# Altium schematic sheet MCU.SchDoc
size 420 x 297 mm
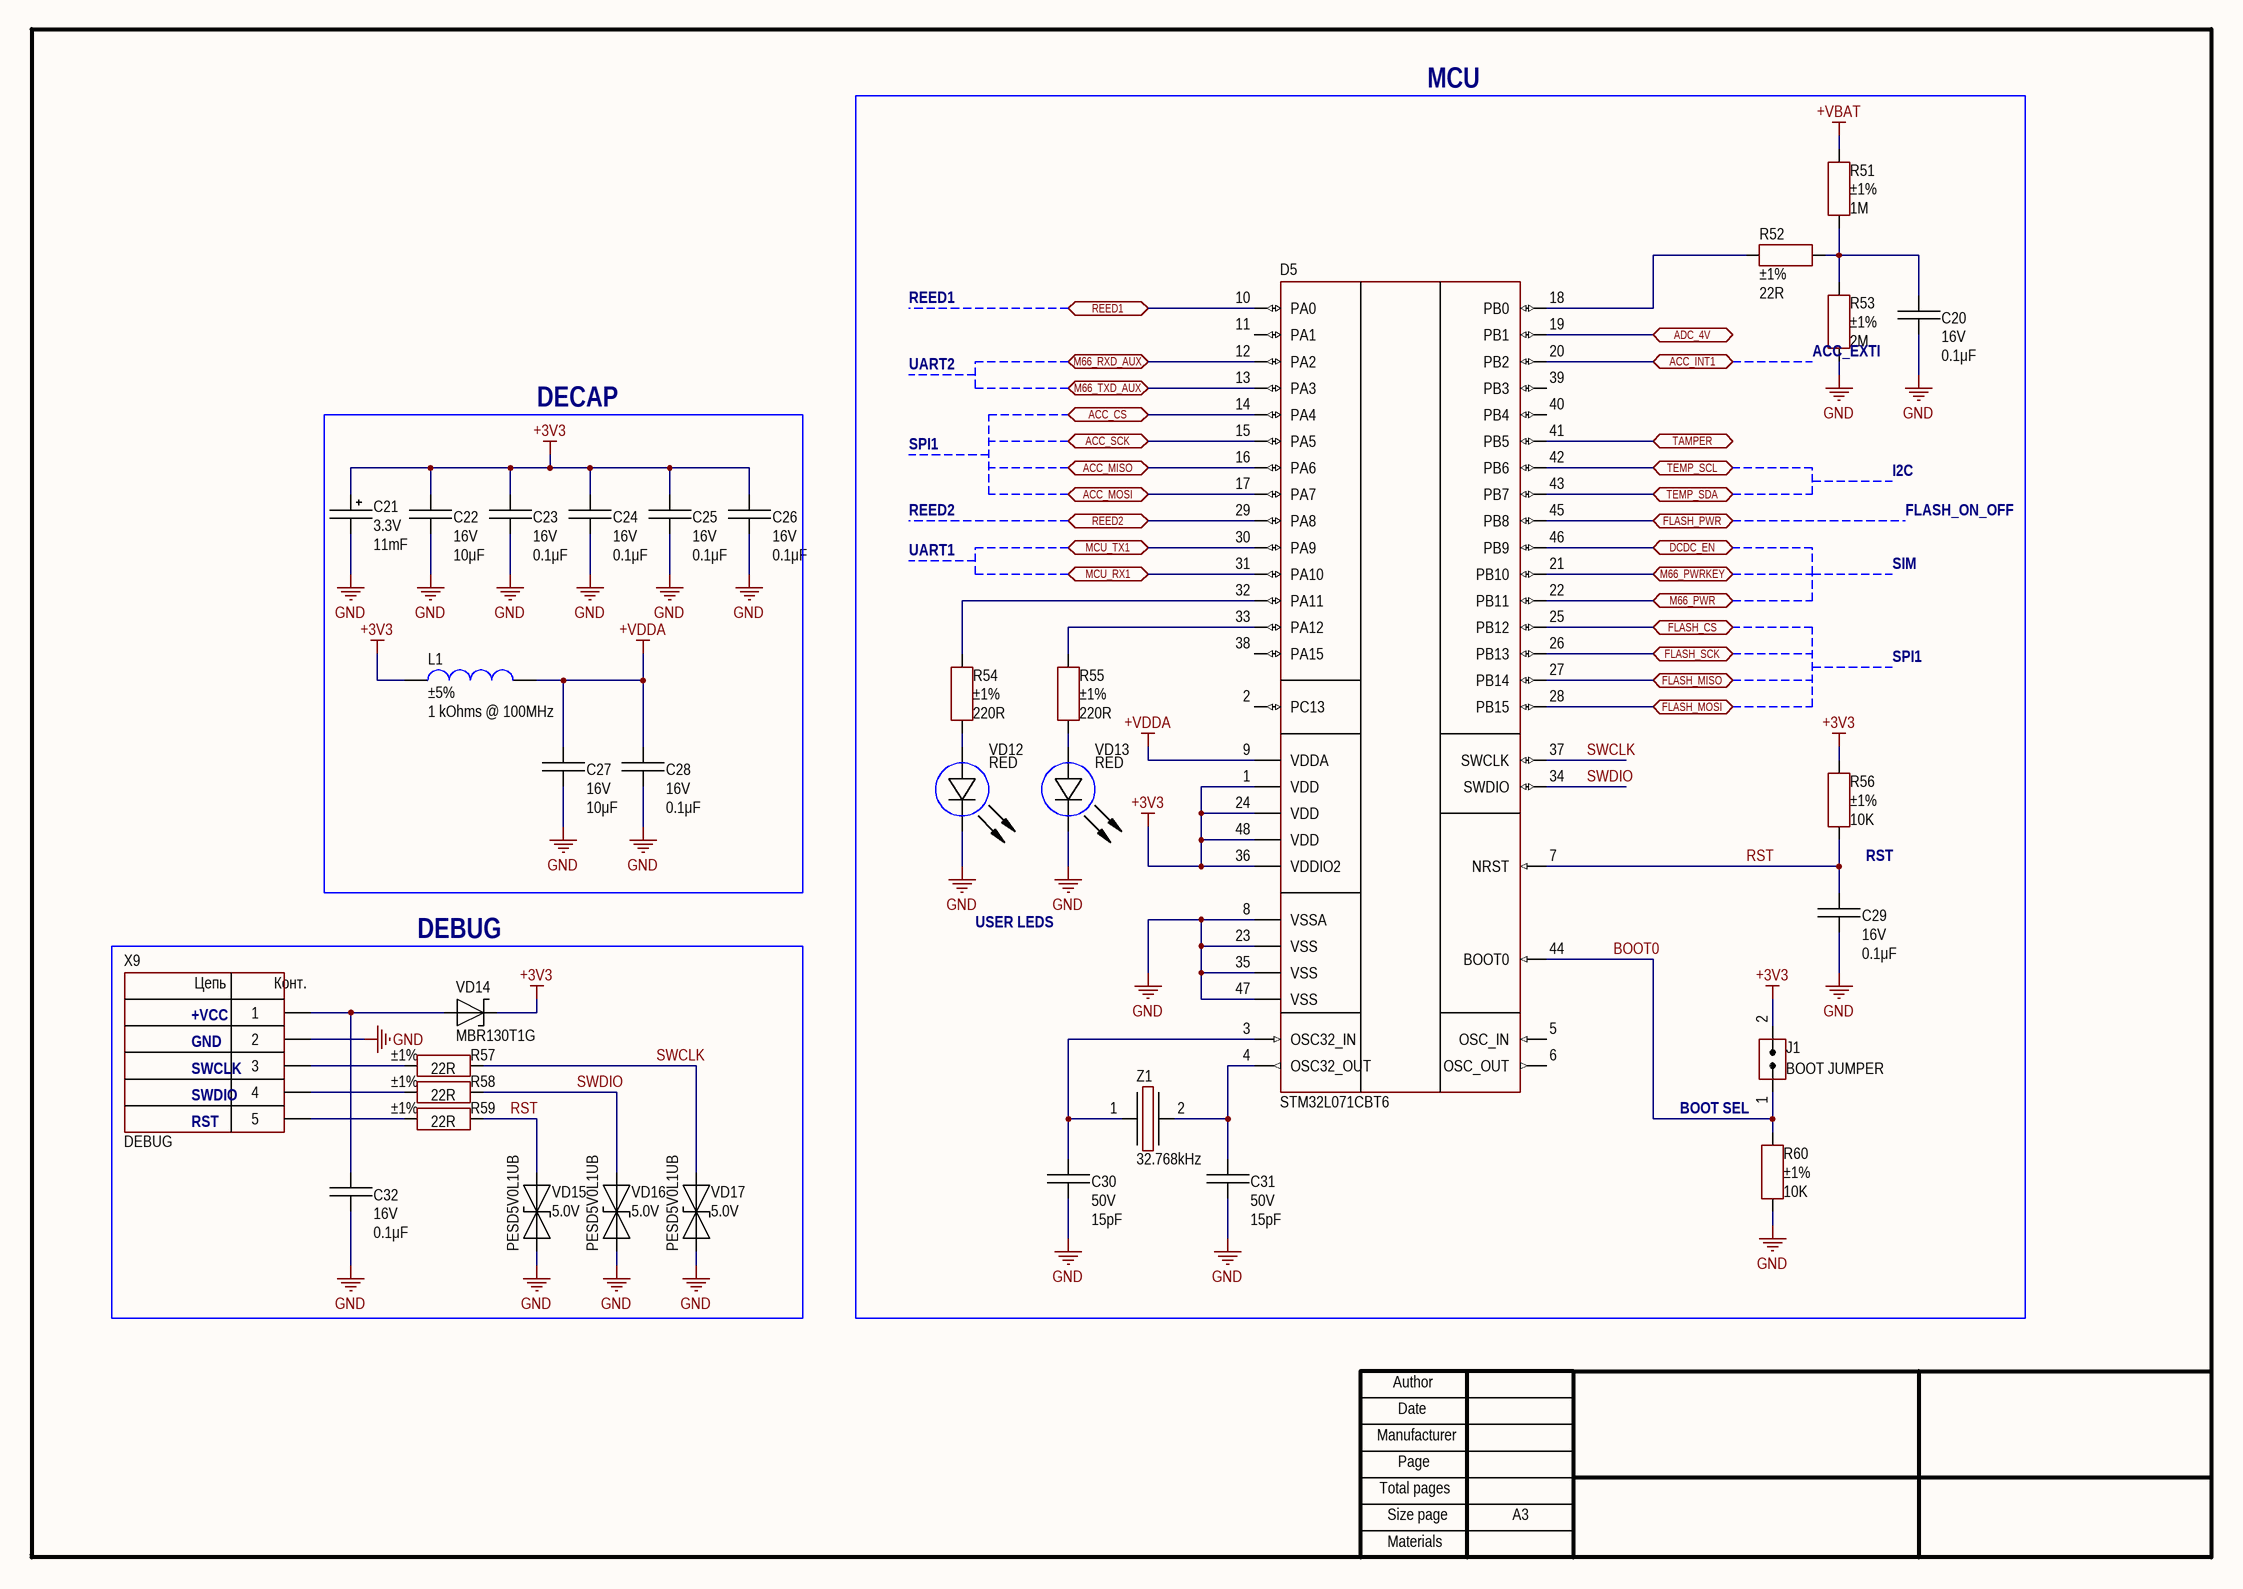
[diagram p0: MCU.SchDoc]

## Parts
C20  value 0.1μF  Voltage: 16V  [CAP: 0402]
C21  value 11mF  Voltage: 3.3V  [CAP: CPH3225A]
C22  value 10μF  Voltage: 16V  [CAP: 0805]
C23  value 0.1μF  Voltage: 16V  [CAP: 0402]
C24  value 0.1μF  Voltage: 16V  [CAP: 0402]
C25  value 0.1μF  Voltage: 16V  [CAP: 0402]
C26  value 0.1μF  Voltage: 16V  [CAP: 0402]
C27  value 10μF  Voltage: 16V  [CAP: 0805]
C28  value 0.1μF  Voltage: 16V  [CAP: 0402]
C29  value 0.1μF  Voltage: 16V  [CAP: 0402]
C30  value 15pF  Voltage: 50V  [CAP: 0402]
C31  value 15pF  Voltage: 50V  [CAP: 0402]
C32  value 0.1μF  Voltage: 16V  [CAP: 0402]
D5  PartNumber: STM32L071CBT6  [48-LQFP]
J1  CommentText: BOOT JUMPER  [CON: JUMPER x1]
L1  value 1 kOhms @ 100MHz  Tolerance: ±5%  [IND: 0402]
R51  value 1M  Tolerance: ±1%  [RES: 0402]
R52  value 22R  Tolerance: ±1%  [RES: 0402]
R53  value 2M  Tolerance: ±1%  [RES: 0402]
R54  value 220R  Tolerance: ±1%  [RES: 0402]
R55  value 220R  Tolerance: ±1%  [RES: 0402]
R56  value 10K  Tolerance: ±1%  [RES: 0402]
R57  value 22R  Tolerance: ±1%  [RES: 0402]
R58  value 22R  Tolerance: ±1%  [RES: 0402]
R59  value 22R  Tolerance: ±1%  [RES: 0402]
R60  value 10K  Tolerance: ±1%  [RES: 0402]
VD12  Color: RED  [LED: 0805R]
VD13  Color: RED  [LED: 0805R]
VD14  PartNumber: MBR130T1G  [DIODE: SOD123]
VD15  Voltage: 5.0V  PartNumber: PESD5V0L1UB  [DIODE: SOD523]
VD16  Voltage: 5.0V  PartNumber: PESD5V0L1UB  [DIODE: SOD523]
VD17  Voltage: 5.0V  PartNumber: PESD5V0L1UB  [DIODE: SOD523]
X9  CommentText: DEBUG  [CON: PLS-5]
Z1  Frequency: 32.768kHz  [OSC: 3215]

## Blocks framed on the sheet
MCU: C20 C29-C31 D5 J1 R51-R56 R60 VD12 VD13 Z1
DECAP: C21-C28 L1
DEBUG: C32 R57-R59 VD14-VD17 X9

## Ports
ACC_CS (bidir), ACC_INT1 (bidir), ACC_MISO (bidir), ACC_MOSI (bidir), ACC_SCK (bidir), ADC_4V (bidir), DCDC_EN (bidir), FLASH_CS (bidir), FLASH_MISO (bidir), FLASH_MOSI (bidir), FLASH_PWR (bidir), FLASH_SCK (bidir), M66_PWR (bidir), M66_PWRKEY (bidir), M66_RXD_AUX (bidir), M66_TXD_AUX (bidir), MCU_RX1 (bidir), MCU_TX1 (bidir), REED1 (bidir), REED2 (bidir), TAMPER (bidir), TEMP_SCL (bidir), TEMP_SDA (bidir)

## Nets
+3V3: C21.1 C22.2 C23.2 C24.2 C25.2 C26.2 D5.1(VDD) D5.24(VDD) D5.36(VDDIO2) D5.48(VDD) J1.2(IN) L1.2 R56.2 VD14.2
+VBAT: R51.2
+VDDA: C27.2 C28.2 D5.9(VDDA) L1.1
GND: C20.1 C21.2 C22.1 C23.1 C24.1 C25.1 C26.1 C27.1 C28.1 C29.1 C30.1 C31.1 C32.1 D5.8(VSSA) D5.23(VSS) D5.35(VSS) D5.47(VSS) R53.1 R60.1 VD12.2(C) VD13.2(C) VD15.1(A) VD16.1(A) VD17.1(A) X9.2
ACC_CS: D5.14(PA4) ; port ACC_CS
ACC_INT1: D5.20(PB2) ; port ACC_INT1
ACC_MISO: D5.16(PA6) ; port ACC_MISO
ACC_MOSI: D5.17(PA7) ; port ACC_MOSI
ACC_SCK: D5.15(PA5) ; port ACC_SCK
ADC_4V: D5.19(PB1) ; port ADC_4V
BOOT0: D5.44(BOOT0) J1.1(IN) R60.2
DCDC_EN: D5.46(PB9) ; port DCDC_EN
FLASH_CS: D5.25(PB12) ; port FLASH_CS
FLASH_MISO: D5.27(PB14) ; port FLASH_MISO
FLASH_MOSI: D5.28(PB15) ; port FLASH_MOSI
FLASH_PWR: D5.45(PB8) ; port FLASH_PWR
FLASH_SCK: D5.26(PB13) ; port FLASH_SCK
M66_PWR: D5.22(PB11) ; port M66_PWR
M66_PWRKEY: D5.21(PB10) ; port M66_PWRKEY
M66_RXD_AUX: D5.12(PA2) ; port M66_RXD_AUX
M66_TXD_AUX: D5.13(PA3) ; port M66_TXD_AUX
MCU_RX1: D5.31(PA10) ; port MCU_RX1
MCU_TX1: D5.30(PA9) ; port MCU_TX1
REED1: D5.10(PA0) ; port REED1
REED2: D5.29(PA8) ; port REED2
RST: C29.2 D5.7(NRST) R56.1 R59.2 VD15.2(C)
SWCLK: D5.37(SWCLK) R57.2 VD17.2(C)
SWDIO: D5.34(SWDIO) R58.2 VD16.2(C)
TAMPER: D5.41(PB5) ; port TAMPER
TEMP_SCL: D5.42(PB6) ; port TEMP_SCL
TEMP_SDA: D5.43(PB7) ; port TEMP_SDA
NetC20_2: C20.2 R51.1 R52.2 R53.2
NetC30_2: C30.2 D5.3(OSC32_IN) Z1.1
NetC31_2: C31.2 D5.4(OSC32_OUT) Z1.2
NetC32_2: C32.2 VD14.1 X9.1
NetD5_18: D5.18(PB0) R52.1
NetD5_32: D5.32(PA11) R54.2
NetD5_33: D5.33(PA12) R55.2
NetR54_1: R54.1 VD12.1(A)
NetR55_1: R55.1 VD13.1(A)
NetR57_1: R57.1 X9.3
NetR58_1: R58.1 X9.4
NetR59_1: R59.1 X9.5

Not connected (* = marked no-connect by the designer): D5 2(PC13) 5(OSC_IN) 6(OSC_OUT) 11(PA1) 38(PA15) 39(PB3) 40(PB4)

## Notes on the sheet
- REED1
- UART2
- (near R53) ACC_EXTI
- SPI1
- REED2
- I2C
- FLASH_ON_OFF
- UART1
- SIM
- RST
- USER LEDS
- +VCC
- GND
- SWCLK
- SWDIO
- BOOT SEL
- Author
- Manufacturer
- Date
- Page
- Total pages
- Size page
- A3
- Materials
- (in symbol PLS-5) Цепь; Конт.

## Library data of the parts
C20 C23-C26 C28 C29 C32 = Ceramic_0402: ±10% 16V Ceramic Capacitor X7R 0402 (1005 Metric); Manufacturer: Yageo; PartNumber: CC0402KRX7R7BB104; ValueManufacturerPartNumber: Ceramic capacitor, 0.1μF, X7R, ±10%, 16V, 0402, -55...+125°C; Package: 0402; HelpURL: https://www.digikey.com/product-detail/en/yageo/CC0402KRX7R7BB104/311-1338-1-ND/2103122; Temperature: -55...+125°C; TypeCapacitor: Ceramic capacitor; Tolerance: ±10%; TypeDielectric: X7R
C21 = CPH3225A: EDLC; Manufacturer: Seiko Instruments; PartNumber: F930J107KAAAJ6; ValueManufacturerPartNumber: EDLC, 11mF, 3.3V, ±10%, 160Ohm, 1210, -55...+125°C; Impedance: 160Ohm; Tolerance: ±10%; TypeDielectric: X7R; Package: 1210; HelpURL: https://www.digikey.com/en/products/detail/seiko-instruments/CPH3225A/8692444; Temperature: -55...+125°C; TypeCapacitor: EDLC
C22 C27 = Ceramic_0805: ±20% 16V Ceramic Capacitor X7R 0805 (2012 Metric); Manufacturer: Yageo; PartNumber: CC0805MKX7R7BB106; ValueManufacturerPartNumber: Ceramic capacitor, 10μF, X7R, ±10%, 16V, 0805, -55...+125°C; Tolerance: ±10%; Package: 0805; HelpURL: https://www.digikey.com/en/products/detail/yageo/CC0805MKX7R7BB106/7164392; Temperature: -55...+125°C; TypeCapacitor: Ceramic capacitor; TypeDielectric: X7R
C30 C31 = Ceramic_0402: ±5% 50V Ceramic Capacitor C0G, NP0 0402 (1005 Metric); Manufacturer: Yageo; PartNumber: CC0402JRNPO9BN150; ValueManufacturerPartNumber: Ceramic capacitor, 15pF, NP0, ±10%, 50V, 0402, -55...+125°C; Tolerance: ±10%; Package: 0402; HelpURL: https://www.digikey.com/en/products/detail/yageo/CC0402JRNPO9BN150/302751; Temperature: -55...+125°C; TypeCapacitor: Ceramic capacitor; TypeDielectric: NP0
D5 = STM32L071C8T6: ARM® Cortex®-M0+ series Microcontroller IC 32-Bit 32MHz 128KB (128K x 8) FLASH 48-LQFP (7x7); Manufacturer: STMicroelectronics; ValueManufacturerPartNumber: IC microcontroller, 32-Bit, Cortex-M0+, 32MHz, 128KB, 20KB, 1.65V...3.6V, -40...+85°C, 48-LQFP; Supply: 1.65V...3.6V; MemoryRAM: 20KB; CoreProcessor: Cortex-M0+; HelpURL: https://www.digikey.com/en/products/detail/stmicroelectronics/STM32L071CBT6/6166982; Package: 48-LQFP; ComponentType: IC microcontroller; Temperature: -40...+85°C; Speed: 32MHz; CoreSize: 32-Bit; MemoryROM: 128KB
J1 = Jumper_single
L1 = Inductor_0402: 100 nH Unshielded Multilayer Inductor 200 mA 1.25Ohm Max 0402 (1005 Metric); Manufacturer: Murata Electronics; PartNumber: LQG15HSR10J02D; ValueManufacturerPartNumber: Ferrite Bead, 1 kOhms @ 100MHz, ±5%, 0402, 200mA, -55...+125°C; TypeInductor: Ferrite Bead; MaxCurrent: 200mA; Package: 0402; HelpURL: https://www.digikey.com/product-detail/en/murata-electronics-north-america/LQG15HSR10J02D/490-2635-1-ND/662915; Temperature: -55...+125°C
R51 = Resistor_0402: 1 MOhms ±1% 0.063W, 1/16W Chip Resistor 0402 (1005 Metric) Moisture Resistant Thick Film; Manufacturer: Yageo; PartNumber: RC0402FR-071ML; ValueManufacturerPartNumber: Resistor film, 1M, ±1%, 0402, 0.063W, -55...+125°C; TypeResistor: Resistor film; Package: 0402; HelpURL: https://www.digikey.com/en/products/detail/yageo/RC0402FR-071ML/726515; Temperature: -55...+125°C; Power: 0.063W
R52 R57-R59 = Resistor_0402: 22 Ohms ±1% 0.063W, 1/16W Chip Resistor 0402 (1005 Metric) Moisture Resistant Thick Film; Manufacturer: Yageo; PartNumber: RC0402FR-0722RL; ValueManufacturerPartNumber: Resistor film, 22R, ±1%, 0402, 0.063W, -55...+125°C; TypeResistor: Resistor film; Package: 0402; HelpURL: https://www.digikey.com/en/products/detail/yageo/RC0402FR-0722RL/726562; Temperature: -55...+125°C; Power: 0.063W
R53 = Resistor_0402: 2 MOhms ±1% 0.063W, 1/16W Chip Resistor 0402 (1005 Metric) Moisture Resistant Thick Film; Manufacturer: Yageo; PartNumber: RC0402FR-072ML; ValueManufacturerPartNumber: Resistor film, 2M, ±1%, 0402, 0.063W, -55...+125°C; TypeResistor: Resistor film; Package: 0402; HelpURL: https://www.digikey.com/en/products/detail/yageo/RC0402FR-072ML/5917635; Temperature: -55...+125°C; Power: 0.063W
R54 R55 = Resistor_0402: 220 Ohms ±1% 0.063W, 1/16W Chip Resistor 0402 (1005 Metric) Moisture Resistant Thick Film; Manufacturer: Yageo; PartNumber: RC0402FR-07220RL; ValueManufacturerPartNumber: Resistor film, 220R, ±1%, 0402, 0.063W, -55...+125°C; TypeResistor: Resistor film; Package: 0402; HelpURL: https://www.digikey.com/en/products/detail/yageo/RC0402FR-07220RL/726565; Temperature: -55...+125°C; Power: 0.063W
R56 R60 = Resistor_0402: 10 kOhms ±1% 0.063W, 1/16W Chip Resistor 0402 (1005 Metric) Moisture Resistant Thick Film; Manufacturer: Yageo; PartNumber: RC0402FR-0710KL; ValueManufacturerPartNumber: Resistor film, 10K, ±1%, 0402, 0.063W, -55...+125°C; TypeResistor: Resistor film; Package: 0402; HelpURL: https://www.digikey.com/en/products/detail/yageo/RC0402FR-0710KL/726523; Temperature: -55...+125°C; Power: 0.063W
VD12 VD13 = LED_single: Red 625nm LED Indication - Discrete 1.8V 0805 (2012 Metric); Manufacturer: Kingbright; ValueManufacturerPartNumber: LED, RED, 30mA, 1.8V, 0805, -55...+150°C; PartNumber: APT2012LSECK/J3-PRV; Current: 30mA; Package: 0805; HelpURL: https://www.digikey.com/en/products/detail/kingbright/APT2012LSECK-J3-PRV/5177436; Temperature: -55...+150°C; TypeDiode: LED; VoltageDrop: 1.8V; ColorParameter: RED
VD14 = Schottky_single: Diode Schottky 30 V 1A Surface Mount SOD-123; Manufacturer: Diodes Incorporated; ValueManufacturerPartNumber: Schottky diode, 30V, 1A, 0.45V, 15pF, SOD-123, -55...+150°C; TypeDiode: Schottky diode; Voltage: 30V; VoltageDrop: 0.45V; RecoveryTime: 15pF; Package: SOD-123; HelpURL: https://www.digikey.com/en/products/detail/on-semiconductor/MBR130T1G/918582; Temperature: -55...+150°C; Current: 1A
VD15-VD17 = TVS_single: 12V Clamp 3.5A (8/20µs) Ipp Tvs Diode Surface Mount SOD-523; Manufacturer: Nexperia; TypeDiode: ESD TVS diode; Package: SOD-523; HelpURL: https://www.digikey.com/en/products/detail/nexperia-usa-inc/PESD5V0L1UB115/2092297; ValueManufacturerPartNumber: =TypeDiode+', '+Voltage+', '+Current+', '+VoltageDrop+', '+RecoveryTime+', '+Package+', '+Temperature; Temperature: -55...+150°C; Current: 3.5A
X9 = PLS-5: Pin Header 5 pin Straight, 2.54mm Through Hole.; Manufacturer: KLS; ValueManufacturerPartNumber: Connector, 5pin, 2.54mm, 500VAC, 0.1A; PartNumber: KLS1-207-1-05-S; TypeConnector: Connector; VoltageMax: 500VAC; CurrentMax: 0.1A; Multichannel: 5pin; HelpURL: https://www.klselectronic.com/kls1-207-2-54mm-pitch-male-pin-header-connectors; Pitch: 2.54mm
Z1 = Crystal_3215: 3215 ±20ppm Crystal 12.5pF 2-SMD, No Lead; Manufacturer: Epson; PartNumber: FC-135 32.7680KA-A5; ValueManufacturerPartNumber: Crystal, 32.768kHz, 12.5pF, ±20ppm, case 3215, -40...+85°C; Package: case 3215; HelpURL: https://www.digikey.com/product-detail/en/epson/FC-135-32.7680KA-A5/SER4103CT-ND/6188447; Temperature: -40...+85°C; TypeOscilator: Crystal; LoadCapacitance: 12.5pF; Tolerance: ±20ppm